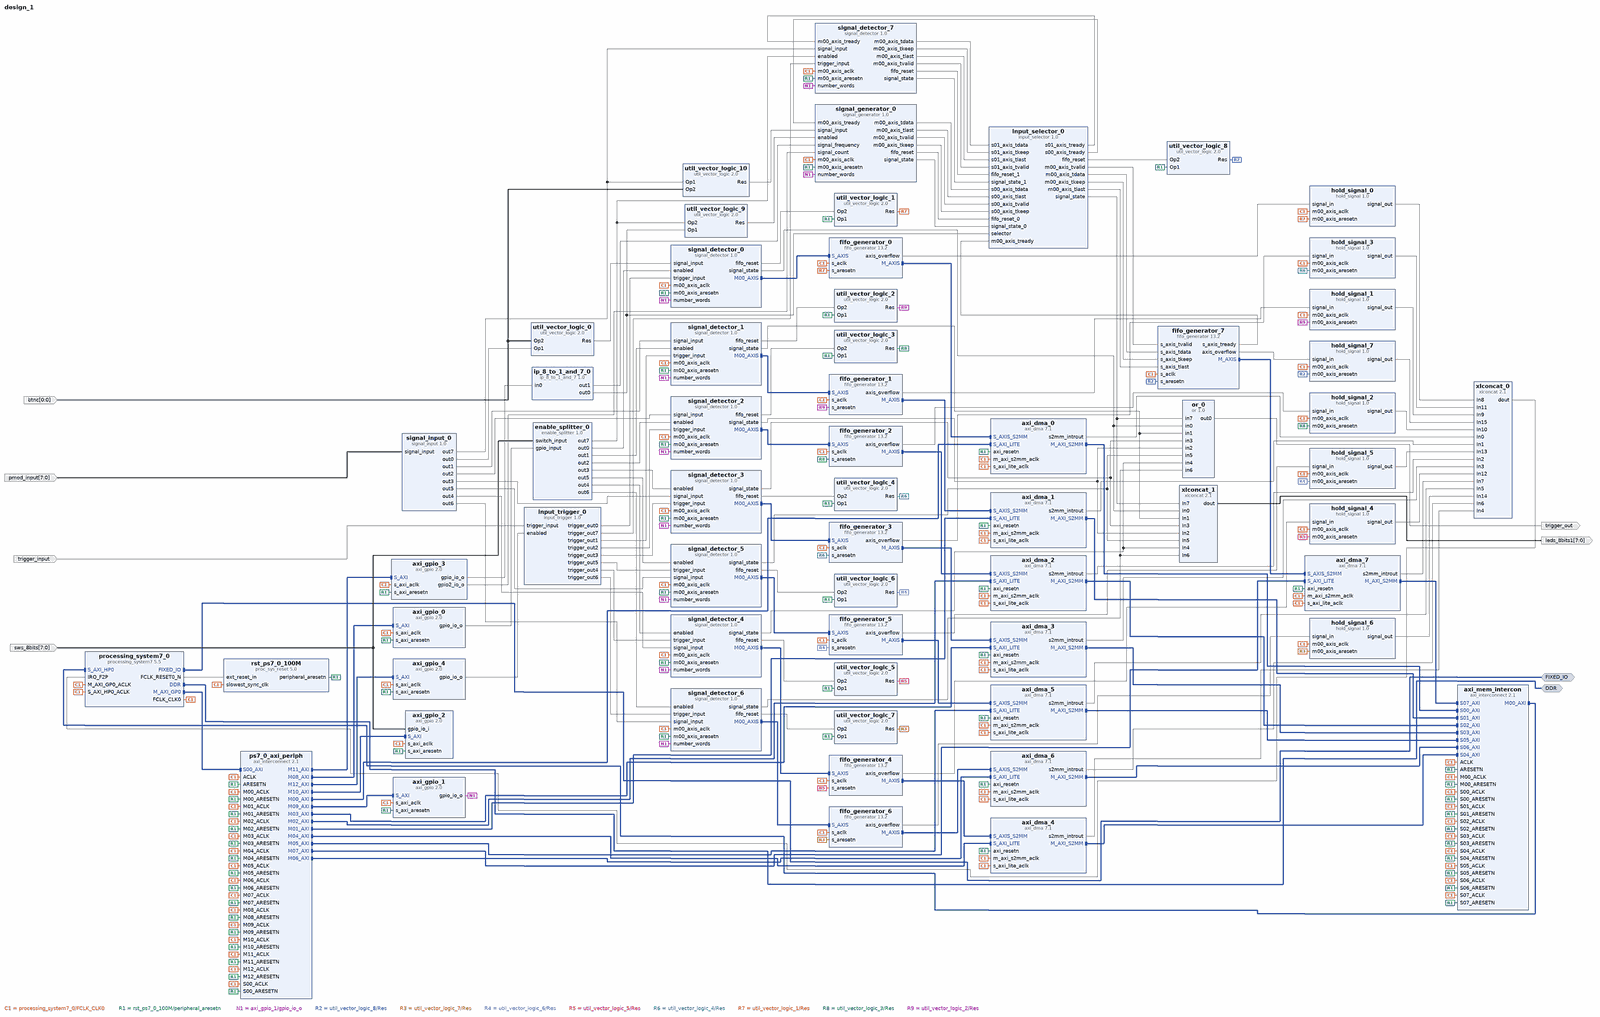
[diagram p0: block diagram of the top level, whole]
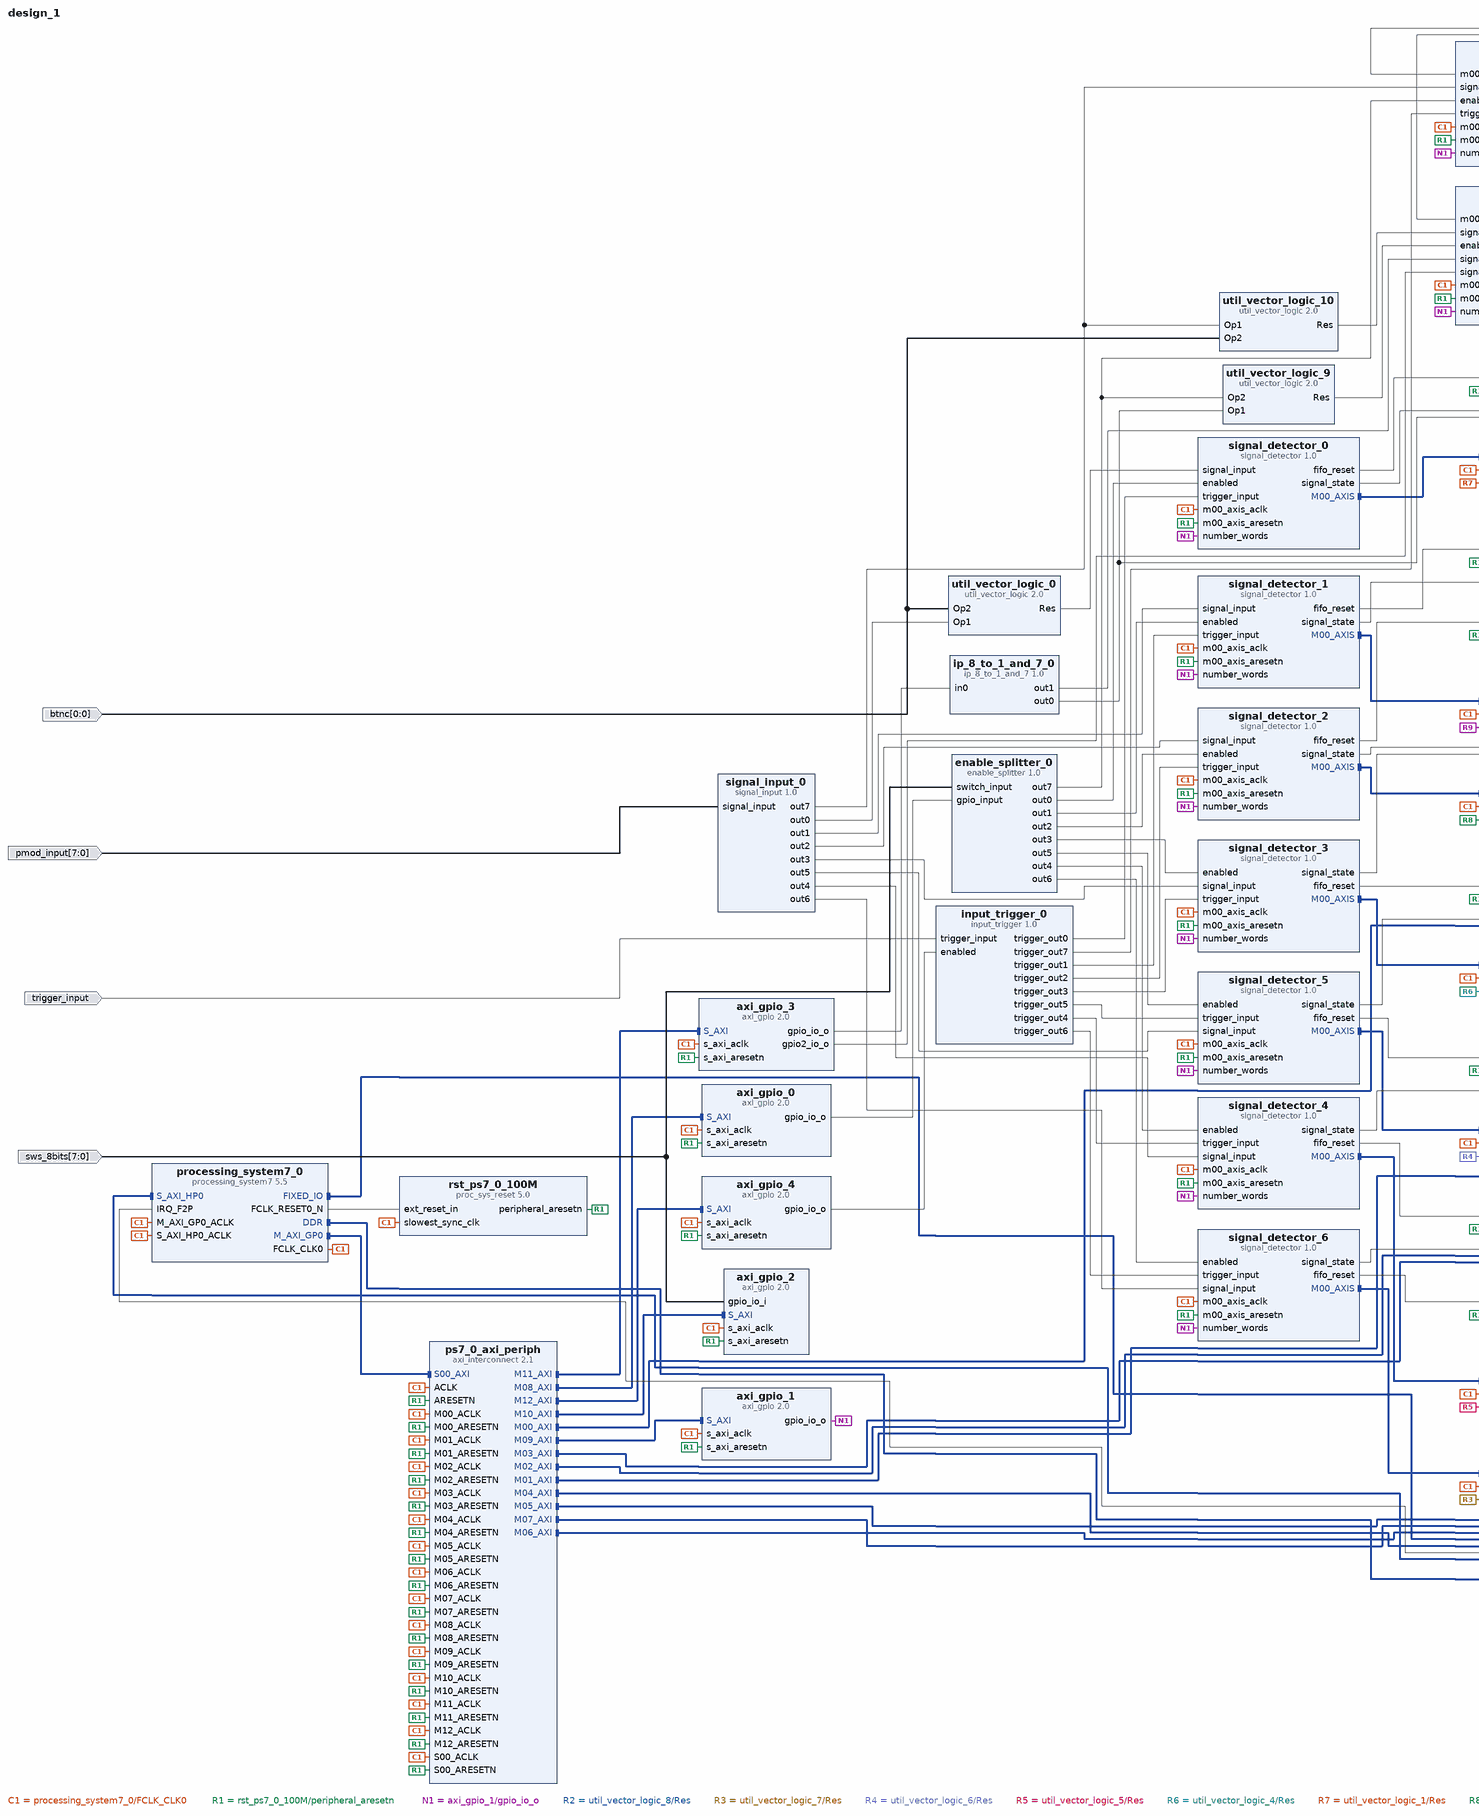
[diagram p1: block diagram of the top level, left part]
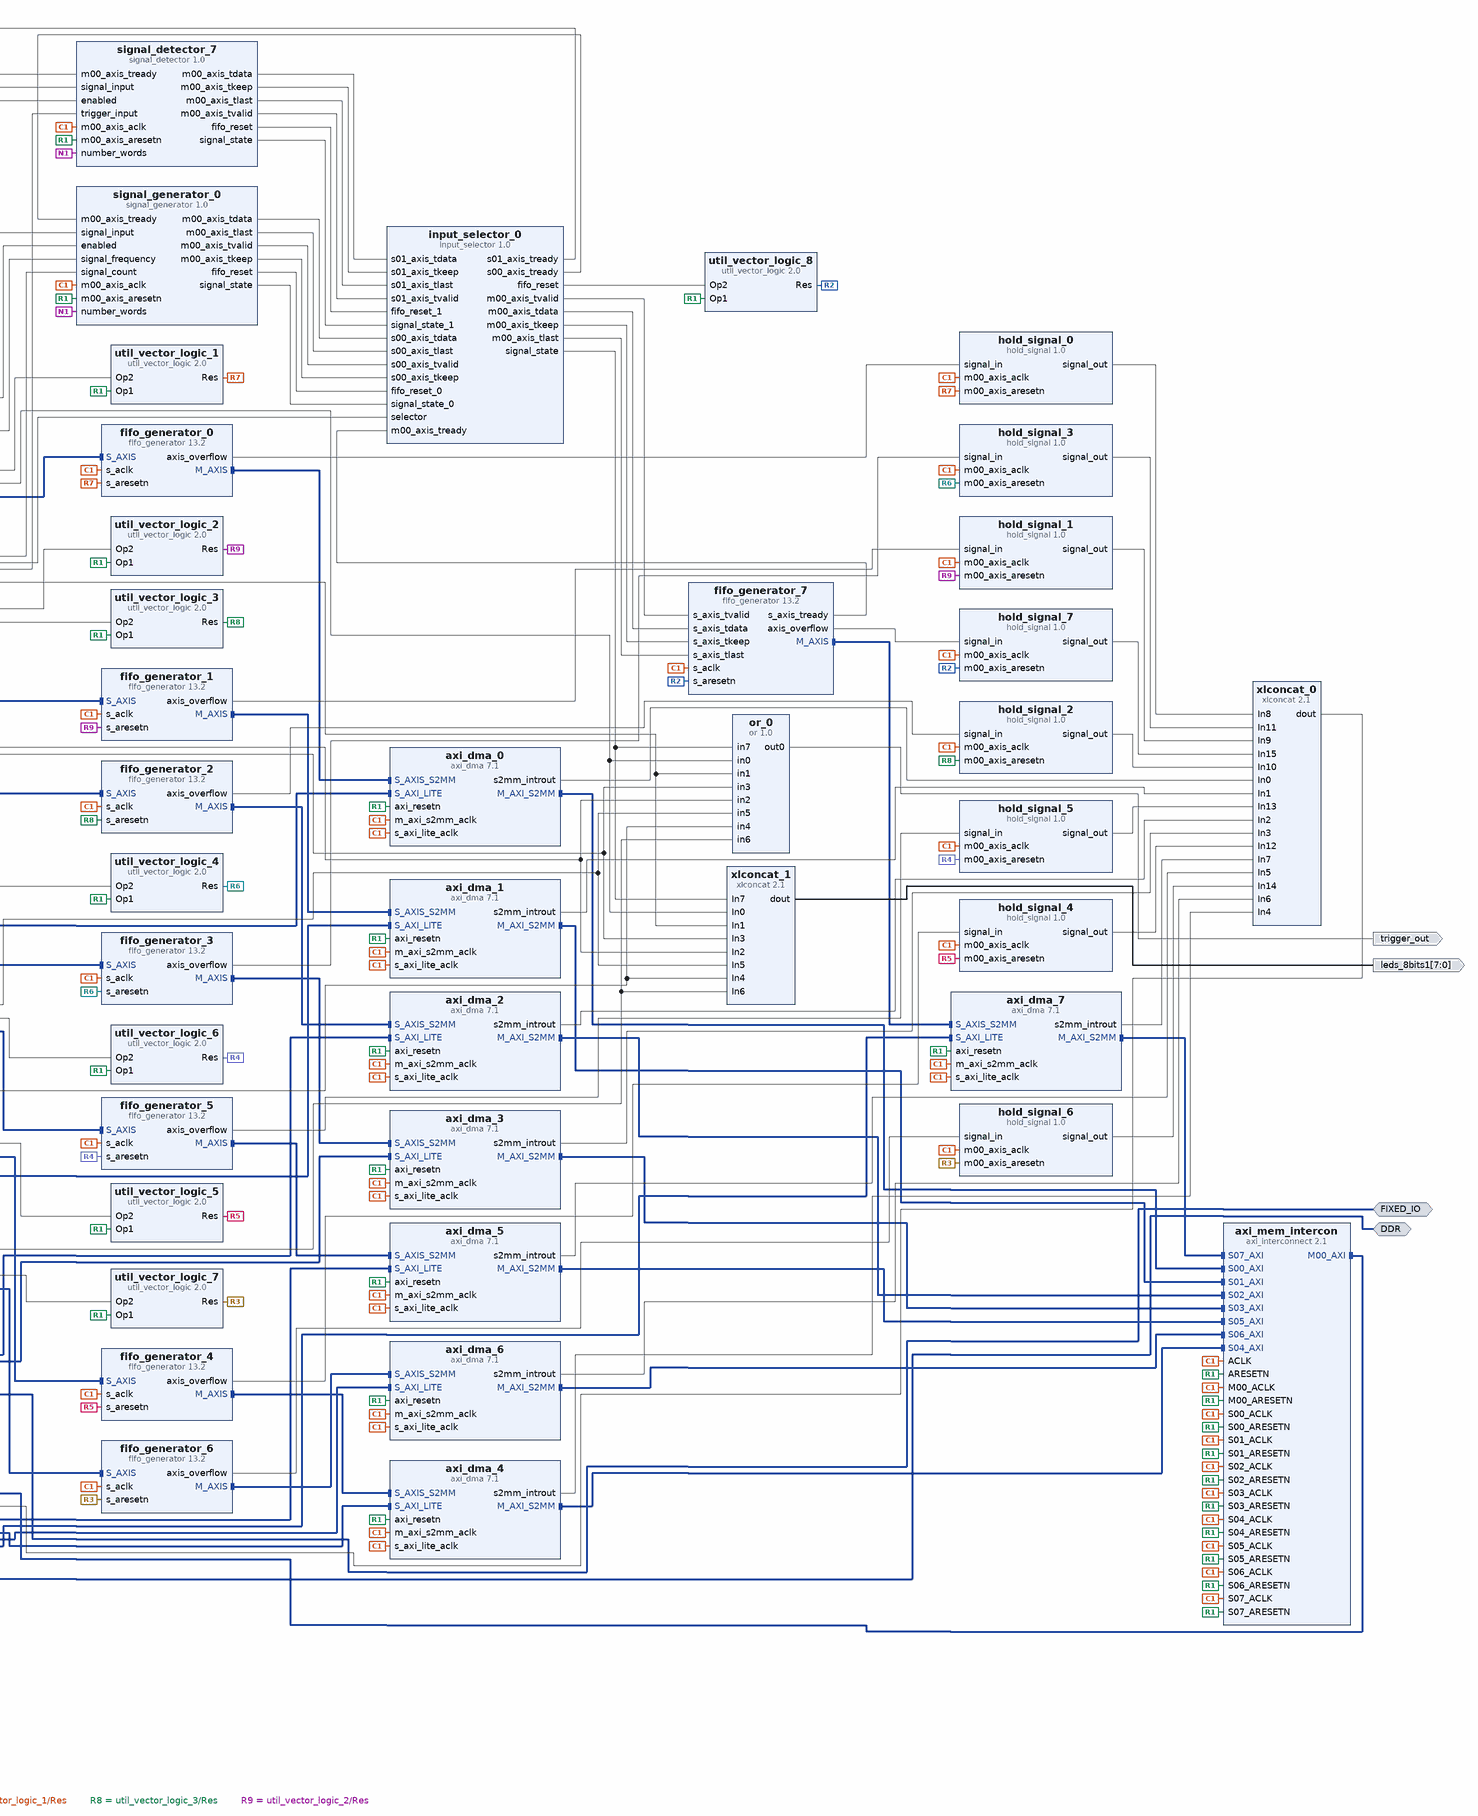
[diagram p2: block diagram of the top level, right part]
# Vivado block design design_1, xc7z020clg484-1, Vivado 2019.2.1
create_bd_design design_1

create_bd_intf_port -mode Master -vlnv xilinx.com:interface:ddrx_rtl:1.0 DDR
create_bd_intf_port -mode Master -vlnv xilinx.com:display_processing_system7:fixedio_rtl:1.0 FIXED_IO
create_bd_port -dir O -from 7 -to 0 leds_8bits1
create_bd_port -dir I -from 7 -to 0 sws_8bits
create_bd_port -dir I -from 7 -to 0 pmod_input
create_bd_port -dir I -from 0 -to 0 btnc
create_bd_port -dir O trigger_out
create_bd_port -dir I trigger_input

create_bd_cell -type ip -vlnv xilinx.com:ip:processing_system7:5.5 processing_system7_0
set_property -dict [list \
  CONFIG.PCW_APU_PERIPHERAL_FREQMHZ 666.666667 \
  CONFIG.PCW_ENET0_ENET0_IO {MIO 16 .. 27} \
  CONFIG.PCW_ENET0_GRP_MDIO_ENABLE 1 \
  CONFIG.PCW_ENET0_GRP_MDIO_IO {MIO 52 .. 53} \
  CONFIG.PCW_ENET0_PERIPHERAL_ENABLE 1 \
  CONFIG.PCW_ENET0_RESET_ENABLE 0 \
  CONFIG.PCW_ENET_RESET_ENABLE 1 \
  CONFIG.PCW_ENET_RESET_SELECT {Share reset pin} \
  CONFIG.PCW_FPGA0_PERIPHERAL_FREQMHZ 100.000000 \
  CONFIG.PCW_FPGA1_PERIPHERAL_FREQMHZ 150.000000 \
  CONFIG.PCW_GPIO_MIO_GPIO_ENABLE 1 \
  CONFIG.PCW_GPIO_MIO_GPIO_IO MIO \
  CONFIG.PCW_I2C_RESET_ENABLE 1 \
  CONFIG.PCW_IRQ_F2P_INTR 1 \
  CONFIG.PCW_PRESET_BANK1_VOLTAGE {LVCMOS 1.8V} \
  CONFIG.PCW_QSPI_GRP_SINGLE_SS_ENABLE 1 \
  CONFIG.PCW_QSPI_GRP_SINGLE_SS_IO {MIO 1 .. 6} \
  CONFIG.PCW_QSPI_PERIPHERAL_ENABLE 1 \
  CONFIG.PCW_QSPI_QSPI_IO {MIO 1 .. 6} \
  CONFIG.PCW_SD0_GRP_CD_ENABLE 1 \
  CONFIG.PCW_SD0_GRP_CD_IO {MIO 47} \
  CONFIG.PCW_SD0_GRP_WP_ENABLE 1 \
  CONFIG.PCW_SD0_GRP_WP_IO {MIO 46} \
  CONFIG.PCW_SD0_PERIPHERAL_ENABLE 1 \
  CONFIG.PCW_SD0_SD0_IO {MIO 40 .. 45} \
  CONFIG.PCW_SDIO_PERIPHERAL_FREQMHZ 50 \
  CONFIG.PCW_SINGLE_QSPI_DATA_MODE x4 \
  CONFIG.PCW_TTC0_PERIPHERAL_ENABLE 1 \
  CONFIG.PCW_TTC0_TTC0_IO EMIO \
  CONFIG.PCW_UART1_PERIPHERAL_ENABLE 1 \
  CONFIG.PCW_UART1_UART1_IO {MIO 48 .. 49} \
  CONFIG.PCW_UART_PERIPHERAL_FREQMHZ 50 \
  CONFIG.PCW_UIPARAM_DDR_FREQ_MHZ 533.333313 \
  CONFIG.PCW_UIPARAM_DDR_PARTNO {MT41J128M16 HA-15E} \
  CONFIG.PCW_USB0_PERIPHERAL_ENABLE 1 \
  CONFIG.PCW_USB0_RESET_ENABLE 0 \
  CONFIG.PCW_USB0_USB0_IO {MIO 28 .. 39} \
  CONFIG.PCW_USB_RESET_ENABLE 1 \
  CONFIG.PCW_USB_RESET_SELECT {Share reset pin} \
  CONFIG.PCW_USE_FABRIC_INTERRUPT 1 \
  CONFIG.PCW_USE_S_AXI_HP0 1 \
  CONFIG.preset ZedBoard \
] [get_bd_cells processing_system7_0]
# 223 more settings of processing_system7_0 are not shown: defaults, MIO pin electricals, DDR timing, and values the tool derives
create_bd_cell -type ip -vlnv xilinx.com:ip:axi_dma:7.1 axi_dma_0
set_property -dict [list \
  CONFIG.c_include_mm2s 0 \
  CONFIG.c_include_sg 0 \
  CONFIG.c_s2mm_burst_size 64 \
  CONFIG.c_sg_length_width 16 \
] [get_bd_cells axi_dma_0]
create_bd_cell -type ip -vlnv xilinx.com:ip:axi_dma:7.1 axi_dma_1
set_property -dict [list \
  CONFIG.c_include_mm2s 0 \
  CONFIG.c_include_sg 0 \
  CONFIG.c_s2mm_burst_size 64 \
  CONFIG.c_sg_length_width 16 \
] [get_bd_cells axi_dma_1]
create_bd_cell -type ip -vlnv xilinx.com:ip:axi_dma:7.1 axi_dma_2
set_property -dict [list \
  CONFIG.c_include_mm2s 0 \
  CONFIG.c_include_sg 0 \
  CONFIG.c_s2mm_burst_size 64 \
  CONFIG.c_sg_length_width 16 \
] [get_bd_cells axi_dma_2]
create_bd_cell -type ip -vlnv xilinx.com:ip:axi_dma:7.1 axi_dma_3
set_property -dict [list \
  CONFIG.c_include_mm2s 0 \
  CONFIG.c_include_sg 0 \
  CONFIG.c_s2mm_burst_size 64 \
  CONFIG.c_sg_length_width 16 \
] [get_bd_cells axi_dma_3]
create_bd_cell -type ip -vlnv xilinx.com:ip:axi_dma:7.1 axi_dma_4
set_property -dict [list \
  CONFIG.c_include_mm2s 0 \
  CONFIG.c_include_sg 0 \
  CONFIG.c_s2mm_burst_size 64 \
  CONFIG.c_sg_length_width 16 \
] [get_bd_cells axi_dma_4]
create_bd_cell -type ip -vlnv xilinx.com:ip:axi_dma:7.1 axi_dma_5
set_property -dict [list \
  CONFIG.c_include_mm2s 0 \
  CONFIG.c_include_sg 0 \
  CONFIG.c_s2mm_burst_size 64 \
  CONFIG.c_sg_length_width 16 \
] [get_bd_cells axi_dma_5]
create_bd_cell -type ip -vlnv xilinx.com:ip:axi_dma:7.1 axi_dma_6
set_property -dict [list \
  CONFIG.c_include_mm2s 0 \
  CONFIG.c_include_sg 0 \
  CONFIG.c_s2mm_burst_size 32 \
  CONFIG.c_sg_length_width 16 \
] [get_bd_cells axi_dma_6]
create_bd_cell -type ip -vlnv xilinx.com:ip:axi_dma:7.1 axi_dma_7
set_property -dict [list \
  CONFIG.c_include_mm2s 0 \
  CONFIG.c_include_sg 0 \
  CONFIG.c_s2mm_burst_size 64 \
  CONFIG.c_sg_length_width 16 \
] [get_bd_cells axi_dma_7]
create_bd_cell -type ip -vlnv xilinx.com:ip:axi_interconnect:2.1 ps7_0_axi_periph
set_property -dict {CONFIG.NUM_MI 13} [get_bd_cells ps7_0_axi_periph]
create_bd_cell -type ip -vlnv xilinx.com:ip:proc_sys_reset:5.0 rst_ps7_0_100M
create_bd_cell -type ip -vlnv xilinx.com:ip:axi_interconnect:2.1 axi_mem_intercon
set_property -dict {CONFIG.NUM_MI 1 CONFIG.NUM_SI 8} [get_bd_cells axi_mem_intercon]
create_bd_cell -type ip -vlnv xilinx.com:ip:xlconcat:2.1 xlconcat_0
set_property -dict {CONFIG.NUM_PORTS 16} [get_bd_cells xlconcat_0]
create_bd_cell -type ip -vlnv xilinx.com:ip:xlconcat:2.1 xlconcat_1
set_property -dict {CONFIG.NUM_PORTS 8} [get_bd_cells xlconcat_1]
create_bd_cell -type ip -vlnv user.org:user:enable_splitter:1.0 enable_splitter_0
create_bd_cell -type ip -vlnv xilinx.com:ip:axi_gpio:2.0 axi_gpio_0
set_property -dict {CONFIG.C_ALL_OUTPUTS 1 CONFIG.C_GPIO_WIDTH 8} [get_bd_cells axi_gpio_0]
create_bd_cell -type ip -vlnv user.org:user:signal_input:1.0 signal_input_0
create_bd_cell -type ip -vlnv xilinx.com:ip:util_vector_logic:2.0 util_vector_logic_0
set_property -dict {CONFIG.C_OPERATION or CONFIG.C_SIZE 1} [get_bd_cells util_vector_logic_0]
create_bd_cell -type ip -vlnv xilinx.com:ip:util_vector_logic:2.0 util_vector_logic_1
set_property -dict {CONFIG.C_SIZE 1} [get_bd_cells util_vector_logic_1]
create_bd_cell -type ip -vlnv xilinx.com:ip:util_vector_logic:2.0 util_vector_logic_2
set_property -dict {CONFIG.C_SIZE 1} [get_bd_cells util_vector_logic_2]
create_bd_cell -type ip -vlnv xilinx.com:ip:util_vector_logic:2.0 util_vector_logic_3
set_property -dict {CONFIG.C_SIZE 1} [get_bd_cells util_vector_logic_3]
create_bd_cell -type ip -vlnv xilinx.com:ip:util_vector_logic:2.0 util_vector_logic_4
set_property -dict {CONFIG.C_SIZE 1} [get_bd_cells util_vector_logic_4]
create_bd_cell -type ip -vlnv xilinx.com:ip:util_vector_logic:2.0 util_vector_logic_5
set_property -dict {CONFIG.C_SIZE 1} [get_bd_cells util_vector_logic_5]
create_bd_cell -type ip -vlnv xilinx.com:ip:util_vector_logic:2.0 util_vector_logic_6
set_property -dict {CONFIG.C_SIZE 1} [get_bd_cells util_vector_logic_6]
create_bd_cell -type ip -vlnv xilinx.com:ip:util_vector_logic:2.0 util_vector_logic_7
set_property -dict {CONFIG.C_SIZE 1} [get_bd_cells util_vector_logic_7]
create_bd_cell -type ip -vlnv xilinx.com:ip:util_vector_logic:2.0 util_vector_logic_8
set_property -dict {CONFIG.C_SIZE 1} [get_bd_cells util_vector_logic_8]
create_bd_cell -type ip -vlnv xilinx.com:ip:axi_gpio:2.0 axi_gpio_1
set_property -dict {CONFIG.C_ALL_OUTPUTS 1 CONFIG.C_DOUT_DEFAULT 0x00000020 CONFIG.C_GPIO_WIDTH 16} [get_bd_cells axi_gpio_1]
create_bd_cell -type ip -vlnv xilinx.com:ip:axi_gpio:2.0 axi_gpio_2
set_property -dict {CONFIG.C_ALL_INPUTS 1 CONFIG.C_GPIO_WIDTH 8} [get_bd_cells axi_gpio_2]
create_bd_cell -type ip -vlnv xilinx.com:ip:util_vector_logic:2.0 util_vector_logic_9
set_property -dict {CONFIG.C_SIZE 1} [get_bd_cells util_vector_logic_9]
create_bd_cell -type ip -vlnv user.org:user:input_selector:1.0 input_selector_0
create_bd_cell -type ip -vlnv xilinx.com:ip:axi_gpio:2.0 axi_gpio_3
set_property -dict [list \
  CONFIG.C_ALL_OUTPUTS 1 \
  CONFIG.C_ALL_OUTPUTS_2 1 \
  CONFIG.C_GPIO_WIDTH 29 \
  CONFIG.C_IS_DUAL 1 \
] [get_bd_cells axi_gpio_3]
create_bd_cell -type ip -vlnv user.org:user:input_trigger:1.0 input_trigger_0
create_bd_cell -type ip -vlnv xilinx.com:ip:axi_gpio:2.0 axi_gpio_4
set_property -dict {CONFIG.C_ALL_OUTPUTS 1 CONFIG.C_GPIO_WIDTH 1} [get_bd_cells axi_gpio_4]
create_bd_cell -type ip -vlnv user.org:user:or:1.0 or_0
create_bd_cell -type ip -vlnv xilinx.com:ip:util_vector_logic:2.0 util_vector_logic_10
set_property -dict {CONFIG.C_OPERATION or CONFIG.C_SIZE 1} [get_bd_cells util_vector_logic_10]
create_bd_cell -type ip -vlnv xilinx.com:ip:fifo_generator:13.2 fifo_generator_0
set_property -dict [list \
  CONFIG.Enable_Data_Counts_axis false \
  CONFIG.Enable_ECC_axis false \
  CONFIG.Enable_Safety_Circuit true \
  CONFIG.Enable_TLAST true \
  CONFIG.FIFO_Implementation_rach Common_Clock_Distributed_RAM \
  CONFIG.FIFO_Implementation_wach Common_Clock_Distributed_RAM \
  CONFIG.FIFO_Implementation_wrch Common_Clock_Distributed_RAM \
  CONFIG.Full_Flags_Reset_Value 1 \
  CONFIG.HAS_ACLKEN false \
  CONFIG.HAS_TKEEP true \
  CONFIG.INTERFACE_TYPE AXI_STREAM \
  CONFIG.Input_Depth_axis 16384 \
  CONFIG.Overflow_Flag_AXI true \
  CONFIG.TDATA_NUM_BYTES 4 \
  CONFIG.TUSER_WIDTH 0 \
] [get_bd_cells fifo_generator_0]
create_bd_cell -type ip -vlnv xilinx.com:ip:fifo_generator:13.2 fifo_generator_1
set_property -dict [list \
  CONFIG.Enable_Data_Counts_axis false \
  CONFIG.Enable_ECC_axis false \
  CONFIG.Enable_Safety_Circuit true \
  CONFIG.Enable_TLAST true \
  CONFIG.FIFO_Implementation_rach Common_Clock_Distributed_RAM \
  CONFIG.FIFO_Implementation_wach Common_Clock_Distributed_RAM \
  CONFIG.FIFO_Implementation_wrch Common_Clock_Distributed_RAM \
  CONFIG.Full_Flags_Reset_Value 1 \
  CONFIG.HAS_ACLKEN false \
  CONFIG.HAS_TKEEP true \
  CONFIG.INTERFACE_TYPE AXI_STREAM \
  CONFIG.Input_Depth_axis 16384 \
  CONFIG.Overflow_Flag_AXI true \
  CONFIG.TDATA_NUM_BYTES 4 \
  CONFIG.TUSER_WIDTH 0 \
] [get_bd_cells fifo_generator_1]
create_bd_cell -type ip -vlnv xilinx.com:ip:fifo_generator:13.2 fifo_generator_2
set_property -dict [list \
  CONFIG.Enable_Data_Counts_axis false \
  CONFIG.Enable_ECC_axis false \
  CONFIG.Enable_Safety_Circuit true \
  CONFIG.Enable_TLAST true \
  CONFIG.FIFO_Implementation_rach Common_Clock_Distributed_RAM \
  CONFIG.FIFO_Implementation_wach Common_Clock_Distributed_RAM \
  CONFIG.FIFO_Implementation_wrch Common_Clock_Distributed_RAM \
  CONFIG.Full_Flags_Reset_Value 1 \
  CONFIG.HAS_ACLKEN false \
  CONFIG.HAS_TKEEP true \
  CONFIG.INTERFACE_TYPE AXI_STREAM \
  CONFIG.Input_Depth_axis 16384 \
  CONFIG.Overflow_Flag_AXI true \
  CONFIG.TDATA_NUM_BYTES 4 \
  CONFIG.TUSER_WIDTH 0 \
] [get_bd_cells fifo_generator_2]
create_bd_cell -type ip -vlnv xilinx.com:ip:fifo_generator:13.2 fifo_generator_3
set_property -dict [list \
  CONFIG.Enable_Data_Counts_axis false \
  CONFIG.Enable_ECC_axis false \
  CONFIG.Enable_Safety_Circuit true \
  CONFIG.Enable_TLAST true \
  CONFIG.FIFO_Implementation_rach Common_Clock_Distributed_RAM \
  CONFIG.FIFO_Implementation_wach Common_Clock_Distributed_RAM \
  CONFIG.FIFO_Implementation_wrch Common_Clock_Distributed_RAM \
  CONFIG.Full_Flags_Reset_Value 1 \
  CONFIG.HAS_ACLKEN false \
  CONFIG.HAS_TKEEP true \
  CONFIG.INTERFACE_TYPE AXI_STREAM \
  CONFIG.Input_Depth_axis 16384 \
  CONFIG.Overflow_Flag_AXI true \
  CONFIG.TDATA_NUM_BYTES 4 \
  CONFIG.TUSER_WIDTH 0 \
] [get_bd_cells fifo_generator_3]
create_bd_cell -type ip -vlnv xilinx.com:ip:fifo_generator:13.2 fifo_generator_4
set_property -dict [list \
  CONFIG.Enable_Data_Counts_axis false \
  CONFIG.Enable_ECC_axis false \
  CONFIG.Enable_Safety_Circuit true \
  CONFIG.Enable_TLAST true \
  CONFIG.FIFO_Implementation_rach Common_Clock_Distributed_RAM \
  CONFIG.FIFO_Implementation_wach Common_Clock_Distributed_RAM \
  CONFIG.FIFO_Implementation_wrch Common_Clock_Distributed_RAM \
  CONFIG.Full_Flags_Reset_Value 1 \
  CONFIG.HAS_ACLKEN false \
  CONFIG.HAS_TKEEP true \
  CONFIG.INTERFACE_TYPE AXI_STREAM \
  CONFIG.Input_Depth_axis 16384 \
  CONFIG.Overflow_Flag_AXI true \
  CONFIG.TDATA_NUM_BYTES 4 \
  CONFIG.TUSER_WIDTH 0 \
] [get_bd_cells fifo_generator_4]
create_bd_cell -type ip -vlnv xilinx.com:ip:fifo_generator:13.2 fifo_generator_5
set_property -dict [list \
  CONFIG.Enable_Data_Counts_axis false \
  CONFIG.Enable_ECC_axis false \
  CONFIG.Enable_Safety_Circuit true \
  CONFIG.Enable_TLAST true \
  CONFIG.FIFO_Implementation_rach Common_Clock_Distributed_RAM \
  CONFIG.FIFO_Implementation_wach Common_Clock_Distributed_RAM \
  CONFIG.FIFO_Implementation_wrch Common_Clock_Distributed_RAM \
  CONFIG.Full_Flags_Reset_Value 1 \
  CONFIG.HAS_ACLKEN false \
  CONFIG.HAS_TKEEP true \
  CONFIG.INTERFACE_TYPE AXI_STREAM \
  CONFIG.Input_Depth_axis 16384 \
  CONFIG.Overflow_Flag_AXI true \
  CONFIG.TDATA_NUM_BYTES 4 \
  CONFIG.TUSER_WIDTH 0 \
] [get_bd_cells fifo_generator_5]
create_bd_cell -type ip -vlnv xilinx.com:ip:fifo_generator:13.2 fifo_generator_6
set_property -dict [list \
  CONFIG.Enable_Data_Counts_axis false \
  CONFIG.Enable_ECC_axis false \
  CONFIG.Enable_Safety_Circuit true \
  CONFIG.Enable_TLAST true \
  CONFIG.FIFO_Implementation_rach Common_Clock_Distributed_RAM \
  CONFIG.FIFO_Implementation_wach Common_Clock_Distributed_RAM \
  CONFIG.FIFO_Implementation_wrch Common_Clock_Distributed_RAM \
  CONFIG.Full_Flags_Reset_Value 1 \
  CONFIG.HAS_ACLKEN false \
  CONFIG.HAS_TKEEP true \
  CONFIG.INTERFACE_TYPE AXI_STREAM \
  CONFIG.Input_Depth_axis 16384 \
  CONFIG.Overflow_Flag_AXI true \
  CONFIG.TDATA_NUM_BYTES 4 \
  CONFIG.TUSER_WIDTH 0 \
] [get_bd_cells fifo_generator_6]
create_bd_cell -type ip -vlnv xilinx.com:ip:fifo_generator:13.2 fifo_generator_7
set_property -dict [list \
  CONFIG.Enable_Data_Counts_axis false \
  CONFIG.Enable_ECC_axis false \
  CONFIG.Enable_Safety_Circuit true \
  CONFIG.Enable_TLAST true \
  CONFIG.FIFO_Implementation_rach Common_Clock_Distributed_RAM \
  CONFIG.FIFO_Implementation_wach Common_Clock_Distributed_RAM \
  CONFIG.FIFO_Implementation_wrch Common_Clock_Distributed_RAM \
  CONFIG.Full_Flags_Reset_Value 1 \
  CONFIG.HAS_ACLKEN false \
  CONFIG.HAS_TKEEP true \
  CONFIG.INTERFACE_TYPE AXI_STREAM \
  CONFIG.Input_Depth_axis 16384 \
  CONFIG.Overflow_Flag_AXI true \
  CONFIG.TDATA_NUM_BYTES 4 \
  CONFIG.TUSER_WIDTH 0 \
] [get_bd_cells fifo_generator_7]
create_bd_cell -type ip -vlnv akr.neutron:user:signal_detector:1.0 signal_detector_0
create_bd_cell -type ip -vlnv akr.neutron:user:signal_detector:1.0 signal_detector_1
create_bd_cell -type ip -vlnv akr.neutron:user:signal_detector:1.0 signal_detector_2
create_bd_cell -type ip -vlnv akr.neutron:user:signal_detector:1.0 signal_detector_3
create_bd_cell -type ip -vlnv akr.neutron:user:signal_detector:1.0 signal_detector_4
create_bd_cell -type ip -vlnv akr.neutron:user:signal_detector:1.0 signal_detector_5
create_bd_cell -type ip -vlnv akr.neutron:user:signal_detector:1.0 signal_detector_7
create_bd_cell -type ip -vlnv akr.neutron:user:signal_detector:1.0 signal_detector_6
create_bd_cell -type ip -vlnv user.org:user:ip_8_to_1_and_7:1.0 ip_8_to_1_and_7_0
create_bd_cell -type ip -vlnv user.org:user:signal_generator:1.0 signal_generator_0
create_bd_cell -type ip -vlnv user.org:user:hold_signal:1.0 hold_signal_0
create_bd_cell -type ip -vlnv user.org:user:hold_signal:1.0 hold_signal_1
create_bd_cell -type ip -vlnv user.org:user:hold_signal:1.0 hold_signal_2
create_bd_cell -type ip -vlnv user.org:user:hold_signal:1.0 hold_signal_3
create_bd_cell -type ip -vlnv user.org:user:hold_signal:1.0 hold_signal_4
create_bd_cell -type ip -vlnv user.org:user:hold_signal:1.0 hold_signal_5
create_bd_cell -type ip -vlnv user.org:user:hold_signal:1.0 hold_signal_6
create_bd_cell -type ip -vlnv user.org:user:hold_signal:1.0 hold_signal_7

# ---- connections ----

connect_bd_intf_net [get_bd_intf_pins fifo_generator_5/M_AXIS] [get_bd_intf_pins axi_dma_5/S_AXIS_S2MM]
connect_bd_intf_net [get_bd_intf_pins fifo_generator_2/M_AXIS] [get_bd_intf_pins axi_dma_2/S_AXIS_S2MM]
connect_bd_intf_net [get_bd_intf_pins signal_detector_1/M00_AXIS] [get_bd_intf_pins fifo_generator_1/S_AXIS]
connect_bd_intf_net [get_bd_intf_pins ps7_0_axi_periph/M04_AXI] [get_bd_intf_pins axi_dma_4/S_AXI_LITE]
connect_bd_intf_net [get_bd_intf_pins axi_dma_0/M_AXI_S2MM] [get_bd_intf_pins axi_mem_intercon/S00_AXI]
connect_bd_intf_net [get_bd_intf_pins signal_detector_3/M00_AXIS] [get_bd_intf_pins fifo_generator_3/S_AXIS]
connect_bd_intf_net [get_bd_intf_pins ps7_0_axi_periph/M12_AXI] [get_bd_intf_pins axi_gpio_4/S_AXI]
connect_bd_intf_net [get_bd_intf_pins axi_dma_0/S_AXIS_S2MM] [get_bd_intf_pins fifo_generator_0/M_AXIS]
connect_bd_intf_net [get_bd_intf_pins ps7_0_axi_periph/M03_AXI] [get_bd_intf_pins axi_dma_3/S_AXI_LITE]
connect_bd_intf_net [get_bd_intf_pins processing_system7_0/M_AXI_GP0] [get_bd_intf_pins ps7_0_axi_periph/S00_AXI]
connect_bd_intf_net [get_bd_intf_pins signal_detector_0/M00_AXIS] [get_bd_intf_pins fifo_generator_0/S_AXIS]
connect_bd_intf_net [get_bd_intf_pins fifo_generator_7/M_AXIS] [get_bd_intf_pins axi_dma_7/S_AXIS_S2MM]
connect_bd_intf_net [get_bd_intf_pins ps7_0_axi_periph/M10_AXI] [get_bd_intf_pins axi_gpio_2/S_AXI]
connect_bd_intf_net [get_bd_intf_pins axi_dma_7/M_AXI_S2MM] [get_bd_intf_pins axi_mem_intercon/S07_AXI]
connect_bd_intf_net [get_bd_intf_pins ps7_0_axi_periph/M08_AXI] [get_bd_intf_pins axi_gpio_0/S_AXI]
connect_bd_intf_net [get_bd_intf_pins axi_dma_2/M_AXI_S2MM] [get_bd_intf_pins axi_mem_intercon/S02_AXI]
connect_bd_intf_net [get_bd_intf_pins fifo_generator_1/M_AXIS] [get_bd_intf_pins axi_dma_1/S_AXIS_S2MM]
connect_bd_intf_net [get_bd_intf_pins axi_dma_6/M_AXI_S2MM] [get_bd_intf_pins axi_mem_intercon/S06_AXI]
connect_bd_intf_net [get_bd_intf_pins signal_detector_2/M00_AXIS] [get_bd_intf_pins fifo_generator_2/S_AXIS]
connect_bd_intf_net [get_bd_intf_pins signal_detector_4/M00_AXIS] [get_bd_intf_pins fifo_generator_4/S_AXIS]
connect_bd_intf_net [get_bd_intf_ports FIXED_IO] [get_bd_intf_pins processing_system7_0/FIXED_IO]
connect_bd_intf_net [get_bd_intf_pins fifo_generator_4/M_AXIS] [get_bd_intf_pins axi_dma_4/S_AXIS_S2MM]
connect_bd_intf_net [get_bd_intf_pins ps7_0_axi_periph/M09_AXI] [get_bd_intf_pins axi_gpio_1/S_AXI]
connect_bd_intf_net [get_bd_intf_pins ps7_0_axi_periph/M02_AXI] [get_bd_intf_pins axi_dma_2/S_AXI_LITE]
connect_bd_intf_net [get_bd_intf_pins axi_dma_3/M_AXI_S2MM] [get_bd_intf_pins axi_mem_intercon/S03_AXI]
connect_bd_intf_net [get_bd_intf_pins ps7_0_axi_periph/M11_AXI] [get_bd_intf_pins axi_gpio_3/S_AXI]
connect_bd_intf_net [get_bd_intf_pins ps7_0_axi_periph/M05_AXI] [get_bd_intf_pins axi_dma_5/S_AXI_LITE]
connect_bd_intf_net [get_bd_intf_pins ps7_0_axi_periph/M00_AXI] [get_bd_intf_pins axi_dma_0/S_AXI_LITE]
connect_bd_intf_net [get_bd_intf_pins fifo_generator_6/M_AXIS] [get_bd_intf_pins axi_dma_6/S_AXIS_S2MM]
connect_bd_intf_net [get_bd_intf_pins ps7_0_axi_periph/M07_AXI] [get_bd_intf_pins axi_dma_7/S_AXI_LITE]
connect_bd_intf_net [get_bd_intf_pins fifo_generator_3/M_AXIS] [get_bd_intf_pins axi_dma_3/S_AXIS_S2MM]
connect_bd_intf_net [get_bd_intf_pins ps7_0_axi_periph/M01_AXI] [get_bd_intf_pins axi_dma_1/S_AXI_LITE]
connect_bd_intf_net [get_bd_intf_pins axi_mem_intercon/M00_AXI] [get_bd_intf_pins processing_system7_0/S_AXI_HP0]
connect_bd_intf_net [get_bd_intf_pins axi_dma_4/M_AXI_S2MM] [get_bd_intf_pins axi_mem_intercon/S04_AXI]
connect_bd_intf_net [get_bd_intf_pins axi_dma_5/M_AXI_S2MM] [get_bd_intf_pins axi_mem_intercon/S05_AXI]
connect_bd_intf_net [get_bd_intf_pins axi_dma_1/M_AXI_S2MM] [get_bd_intf_pins axi_mem_intercon/S01_AXI]
connect_bd_intf_net [get_bd_intf_pins signal_detector_6/M00_AXIS] [get_bd_intf_pins fifo_generator_6/S_AXIS]
connect_bd_intf_net [get_bd_intf_pins signal_detector_5/M00_AXIS] [get_bd_intf_pins fifo_generator_5/S_AXIS]
connect_bd_intf_net [get_bd_intf_pins ps7_0_axi_periph/M06_AXI] [get_bd_intf_pins axi_dma_6/S_AXI_LITE]
connect_bd_intf_net [get_bd_intf_ports DDR] [get_bd_intf_pins processing_system7_0/DDR]
connect_bd_net [get_bd_pins processing_system7_0/FCLK_CLK0] \
  [get_bd_pins processing_system7_0/M_AXI_GP0_ACLK] [get_bd_pins ps7_0_axi_periph/S00_ACLK] \
  [get_bd_pins rst_ps7_0_100M/slowest_sync_clk] [get_bd_pins axi_dma_0/s_axi_lite_aclk] \
  [get_bd_pins ps7_0_axi_periph/M00_ACLK] [get_bd_pins ps7_0_axi_periph/ACLK] [get_bd_pins axi_dma_1/s_axi_lite_aclk] \
  [get_bd_pins ps7_0_axi_periph/M01_ACLK] [get_bd_pins axi_dma_2/s_axi_lite_aclk] [get_bd_pins ps7_0_axi_periph/M02_ACLK] \
  [get_bd_pins axi_dma_3/s_axi_lite_aclk] [get_bd_pins ps7_0_axi_periph/M03_ACLK] [get_bd_pins axi_dma_4/s_axi_lite_aclk] \
  [get_bd_pins ps7_0_axi_periph/M04_ACLK] [get_bd_pins axi_dma_5/s_axi_lite_aclk] [get_bd_pins ps7_0_axi_periph/M05_ACLK] \
  [get_bd_pins axi_dma_6/s_axi_lite_aclk] [get_bd_pins ps7_0_axi_periph/M06_ACLK] [get_bd_pins axi_dma_7/s_axi_lite_aclk] \
  [get_bd_pins ps7_0_axi_periph/M07_ACLK] [get_bd_pins axi_dma_0/m_axi_s2mm_aclk] [get_bd_pins axi_mem_intercon/S00_ACLK] \
  [get_bd_pins processing_system7_0/S_AXI_HP0_ACLK] [get_bd_pins axi_mem_intercon/M00_ACLK] \
  [get_bd_pins axi_mem_intercon/ACLK] [get_bd_pins axi_dma_1/m_axi_s2mm_aclk] [get_bd_pins axi_dma_2/m_axi_s2mm_aclk] \
  [get_bd_pins axi_dma_3/m_axi_s2mm_aclk] [get_bd_pins axi_dma_4/m_axi_s2mm_aclk] [get_bd_pins axi_dma_5/m_axi_s2mm_aclk] \
  [get_bd_pins axi_dma_6/m_axi_s2mm_aclk] [get_bd_pins axi_dma_7/m_axi_s2mm_aclk] [get_bd_pins axi_mem_intercon/S01_ACLK] \
  [get_bd_pins axi_mem_intercon/S02_ACLK] [get_bd_pins axi_mem_intercon/S03_ACLK] [get_bd_pins axi_mem_intercon/S04_ACLK] \
  [get_bd_pins axi_mem_intercon/S05_ACLK] [get_bd_pins axi_mem_intercon/S06_ACLK] [get_bd_pins axi_mem_intercon/S07_ACLK] \
  [get_bd_pins axi_gpio_0/s_axi_aclk] [get_bd_pins ps7_0_axi_periph/M08_ACLK] [get_bd_pins ps7_0_axi_periph/M09_ACLK] \
  [get_bd_pins axi_gpio_1/s_axi_aclk] [get_bd_pins axi_gpio_2/s_axi_aclk] [get_bd_pins ps7_0_axi_periph/M10_ACLK] \
  [get_bd_pins axi_gpio_3/s_axi_aclk] [get_bd_pins ps7_0_axi_periph/M11_ACLK] [get_bd_pins axi_gpio_4/s_axi_aclk] \
  [get_bd_pins ps7_0_axi_periph/M12_ACLK] [get_bd_pins fifo_generator_0/s_aclk] [get_bd_pins fifo_generator_1/s_aclk] \
  [get_bd_pins fifo_generator_2/s_aclk] [get_bd_pins fifo_generator_3/s_aclk] [get_bd_pins fifo_generator_4/s_aclk] \
  [get_bd_pins fifo_generator_5/s_aclk] [get_bd_pins fifo_generator_6/s_aclk] [get_bd_pins fifo_generator_7/s_aclk] \
  [get_bd_pins signal_detector_0/m00_axis_aclk] [get_bd_pins signal_detector_1/m00_axis_aclk] \
  [get_bd_pins signal_detector_2/m00_axis_aclk] [get_bd_pins signal_detector_3/m00_axis_aclk] \
  [get_bd_pins signal_detector_4/m00_axis_aclk] [get_bd_pins signal_detector_5/m00_axis_aclk] \
  [get_bd_pins signal_detector_7/m00_axis_aclk] [get_bd_pins signal_detector_6/m00_axis_aclk] \
  [get_bd_pins signal_generator_0/m00_axis_aclk] [get_bd_pins hold_signal_2/m00_axis_aclk] \
  [get_bd_pins hold_signal_4/m00_axis_aclk] [get_bd_pins hold_signal_5/m00_axis_aclk] \
  [get_bd_pins hold_signal_7/m00_axis_aclk] [get_bd_pins hold_signal_6/m00_axis_aclk] \
  [get_bd_pins hold_signal_3/m00_axis_aclk] [get_bd_pins hold_signal_0/m00_axis_aclk] \
  [get_bd_pins hold_signal_1/m00_axis_aclk]
connect_bd_net [get_bd_pins processing_system7_0/FCLK_RESET0_N] [get_bd_pins rst_ps7_0_100M/ext_reset_in]
connect_bd_net [get_bd_pins rst_ps7_0_100M/peripheral_aresetn] \
  [get_bd_pins ps7_0_axi_periph/S00_ARESETN] [get_bd_pins axi_dma_0/axi_resetn] [get_bd_pins ps7_0_axi_periph/M00_ARESETN] \
  [get_bd_pins ps7_0_axi_periph/ARESETN] [get_bd_pins axi_dma_1/axi_resetn] [get_bd_pins ps7_0_axi_periph/M01_ARESETN] \
  [get_bd_pins axi_dma_2/axi_resetn] [get_bd_pins ps7_0_axi_periph/M02_ARESETN] [get_bd_pins axi_dma_3/axi_resetn] \
  [get_bd_pins ps7_0_axi_periph/M03_ARESETN] [get_bd_pins axi_dma_4/axi_resetn] [get_bd_pins ps7_0_axi_periph/M04_ARESETN] \
  [get_bd_pins axi_dma_5/axi_resetn] [get_bd_pins ps7_0_axi_periph/M05_ARESETN] [get_bd_pins axi_dma_6/axi_resetn] \
  [get_bd_pins ps7_0_axi_periph/M06_ARESETN] [get_bd_pins axi_dma_7/axi_resetn] [get_bd_pins ps7_0_axi_periph/M07_ARESETN] \
  [get_bd_pins axi_mem_intercon/S00_ARESETN] [get_bd_pins axi_mem_intercon/M00_ARESETN] \
  [get_bd_pins axi_mem_intercon/ARESETN] [get_bd_pins axi_mem_intercon/S01_ARESETN] \
  [get_bd_pins axi_mem_intercon/S02_ARESETN] [get_bd_pins axi_mem_intercon/S03_ARESETN] \
  [get_bd_pins axi_mem_intercon/S04_ARESETN] [get_bd_pins axi_mem_intercon/S05_ARESETN] \
  [get_bd_pins axi_mem_intercon/S06_ARESETN] [get_bd_pins axi_mem_intercon/S07_ARESETN] \
  [get_bd_pins axi_gpio_0/s_axi_aresetn] [get_bd_pins ps7_0_axi_periph/M08_ARESETN] [get_bd_pins util_vector_logic_1/Op1] \
  [get_bd_pins util_vector_logic_3/Op1] [get_bd_pins util_vector_logic_5/Op1] [get_bd_pins util_vector_logic_6/Op1] \
  [get_bd_pins util_vector_logic_4/Op1] [get_bd_pins util_vector_logic_8/Op1] [get_bd_pins util_vector_logic_7/Op1] \
  [get_bd_pins util_vector_logic_2/Op1] [get_bd_pins ps7_0_axi_periph/M09_ARESETN] [get_bd_pins axi_gpio_1/s_axi_aresetn] \
  [get_bd_pins axi_gpio_2/s_axi_aresetn] [get_bd_pins ps7_0_axi_periph/M10_ARESETN] [get_bd_pins axi_gpio_3/s_axi_aresetn] \
  [get_bd_pins ps7_0_axi_periph/M11_ARESETN] [get_bd_pins axi_gpio_4/s_axi_aresetn] \
  [get_bd_pins ps7_0_axi_periph/M12_ARESETN] [get_bd_pins signal_detector_0/m00_axis_aresetn] \
  [get_bd_pins signal_detector_1/m00_axis_aresetn] [get_bd_pins signal_detector_2/m00_axis_aresetn] \
  [get_bd_pins signal_detector_3/m00_axis_aresetn] [get_bd_pins signal_detector_4/m00_axis_aresetn] \
  [get_bd_pins signal_detector_5/m00_axis_aresetn] [get_bd_pins signal_detector_7/m00_axis_aresetn] \
  [get_bd_pins signal_detector_6/m00_axis_aresetn] [get_bd_pins signal_generator_0/m00_axis_aresetn]
connect_bd_net [get_bd_pins axi_dma_7/s2mm_introut] [get_bd_pins xlconcat_0/In7]
connect_bd_net [get_bd_pins axi_dma_6/s2mm_introut] [get_bd_pins xlconcat_0/In6]
connect_bd_net [get_bd_pins axi_dma_5/s2mm_introut] [get_bd_pins xlconcat_0/In5]
connect_bd_net [get_bd_pins axi_dma_0/s2mm_introut] [get_bd_pins xlconcat_0/In0]
connect_bd_net [get_bd_pins axi_dma_4/s2mm_introut] [get_bd_pins xlconcat_0/In4]
connect_bd_net [get_bd_pins axi_dma_3/s2mm_introut] [get_bd_pins xlconcat_0/In3]
connect_bd_net [get_bd_pins axi_dma_2/s2mm_introut] [get_bd_pins xlconcat_0/In2]
connect_bd_net [get_bd_pins axi_dma_1/s2mm_introut] [get_bd_pins xlconcat_0/In1]
connect_bd_net [get_bd_pins xlconcat_0/dout] [get_bd_pins processing_system7_0/IRQ_F2P]
connect_bd_net [get_bd_pins signal_detector_5/signal_state] [get_bd_pins xlconcat_1/In5] [get_bd_pins or_0/in5]
connect_bd_net [get_bd_pins signal_detector_0/signal_state] [get_bd_pins xlconcat_1/In0] [get_bd_pins or_0/in0]
connect_bd_net [get_bd_pins signal_detector_4/signal_state] [get_bd_pins xlconcat_1/In4] [get_bd_pins or_0/in4]
connect_bd_net [get_bd_pins signal_detector_3/signal_state] [get_bd_pins xlconcat_1/In3] [get_bd_pins or_0/in3]
connect_bd_net [get_bd_pins signal_detector_2/signal_state] [get_bd_pins xlconcat_1/In2] [get_bd_pins or_0/in2]
connect_bd_net [get_bd_pins signal_detector_1/signal_state] [get_bd_pins xlconcat_1/In1] [get_bd_pins or_0/in1]
connect_bd_net [get_bd_pins xlconcat_1/dout] [get_bd_ports leds_8bits1]
connect_bd_net [get_bd_pins enable_splitter_0/out7] [get_bd_pins util_vector_logic_9/Op2] [get_bd_pins signal_detector_7/enabled]
connect_bd_net [get_bd_pins enable_splitter_0/out5] [get_bd_pins signal_detector_5/enabled]
connect_bd_net [get_bd_pins enable_splitter_0/out4] [get_bd_pins signal_detector_4/enabled]
connect_bd_net [get_bd_pins enable_splitter_0/out3] [get_bd_pins signal_detector_3/enabled]
connect_bd_net [get_bd_pins enable_splitter_0/out2] [get_bd_pins signal_detector_2/enabled]
connect_bd_net [get_bd_pins enable_splitter_0/out1] [get_bd_pins signal_detector_1/enabled]
connect_bd_net [get_bd_ports sws_8bits] [get_bd_pins enable_splitter_0/switch_input] [get_bd_pins axi_gpio_2/gpio_io_i]
connect_bd_net [get_bd_pins axi_gpio_0/gpio_io_o] [get_bd_pins enable_splitter_0/gpio_input]
connect_bd_net [get_bd_pins signal_input_0/out1] [get_bd_pins signal_detector_1/signal_input]
connect_bd_net [get_bd_pins signal_input_0/out2] [get_bd_pins signal_detector_2/signal_input]
connect_bd_net [get_bd_pins signal_input_0/out3] [get_bd_pins signal_detector_3/signal_input]
connect_bd_net [get_bd_pins signal_input_0/out4] [get_bd_pins signal_detector_4/signal_input]
connect_bd_net [get_bd_pins signal_input_0/out5] [get_bd_pins signal_detector_5/signal_input]
connect_bd_net [get_bd_pins signal_input_0/out7] [get_bd_pins util_vector_logic_10/Op1] [get_bd_pins signal_detector_7/signal_input]
connect_bd_net [get_bd_ports pmod_input] [get_bd_pins signal_input_0/signal_input]
connect_bd_net [get_bd_pins enable_splitter_0/out0] [get_bd_pins signal_detector_0/enabled]
connect_bd_net [get_bd_pins signal_input_0/out0] [get_bd_pins util_vector_logic_0/Op1]
connect_bd_net [get_bd_pins util_vector_logic_0/Res] [get_bd_pins signal_detector_0/signal_input]
connect_bd_net [get_bd_pins signal_detector_0/fifo_reset] [get_bd_pins util_vector_logic_1/Op2]
connect_bd_net [get_bd_pins signal_detector_2/fifo_reset] [get_bd_pins util_vector_logic_3/Op2]
connect_bd_net [get_bd_pins signal_detector_3/fifo_reset] [get_bd_pins util_vector_logic_4/Op2]
connect_bd_net [get_bd_pins signal_detector_4/fifo_reset] [get_bd_pins util_vector_logic_5/Op2]
connect_bd_net [get_bd_pins signal_detector_5/fifo_reset] [get_bd_pins util_vector_logic_6/Op2]
connect_bd_net [get_bd_pins signal_detector_1/fifo_reset] [get_bd_pins util_vector_logic_2/Op2]
connect_bd_net [get_bd_pins axi_gpio_1/gpio_io_o] \
  [get_bd_pins signal_detector_0/number_words] [get_bd_pins signal_detector_1/number_words] \
  [get_bd_pins signal_detector_2/number_words] [get_bd_pins signal_detector_3/number_words] \
  [get_bd_pins signal_detector_4/number_words] [get_bd_pins signal_detector_5/number_words] \
  [get_bd_pins signal_detector_7/number_words] [get_bd_pins signal_detector_6/number_words] \
  [get_bd_pins signal_generator_0/number_words]
connect_bd_net [get_bd_pins signal_detector_6/signal_state] [get_bd_pins xlconcat_1/In6] [get_bd_pins or_0/in6]
connect_bd_net [get_bd_pins signal_detector_6/fifo_reset] [get_bd_pins util_vector_logic_7/Op2]
connect_bd_net [get_bd_pins enable_splitter_0/out6] [get_bd_pins signal_detector_6/enabled]
connect_bd_net [get_bd_pins signal_input_0/out6] [get_bd_pins signal_detector_6/signal_input]
connect_bd_net [get_bd_pins util_vector_logic_9/Res] [get_bd_pins signal_generator_0/enabled]
connect_bd_net [get_bd_pins signal_detector_7/m00_axis_tdata] [get_bd_pins input_selector_0/s01_axis_tdata]
connect_bd_net [get_bd_pins signal_detector_7/m00_axis_tkeep] [get_bd_pins input_selector_0/s01_axis_tkeep]
connect_bd_net [get_bd_pins signal_detector_7/m00_axis_tlast] [get_bd_pins input_selector_0/s01_axis_tlast]
connect_bd_net [get_bd_pins signal_detector_7/m00_axis_tvalid] [get_bd_pins input_selector_0/s01_axis_tvalid]
connect_bd_net [get_bd_pins input_selector_0/s01_axis_tready] [get_bd_pins signal_detector_7/m00_axis_tready]
connect_bd_net [get_bd_pins input_selector_0/s00_axis_tready] [get_bd_pins signal_generator_0/m00_axis_tready]
connect_bd_net [get_bd_pins signal_generator_0/m00_axis_tdata] [get_bd_pins input_selector_0/s00_axis_tdata]
connect_bd_net [get_bd_pins signal_generator_0/m00_axis_tlast] [get_bd_pins input_selector_0/s00_axis_tlast]
connect_bd_net [get_bd_pins signal_generator_0/m00_axis_tvalid] [get_bd_pins input_selector_0/s00_axis_tvalid]
connect_bd_net [get_bd_pins signal_generator_0/m00_axis_tkeep] [get_bd_pins input_selector_0/s00_axis_tkeep]
connect_bd_net [get_bd_pins input_selector_0/fifo_reset] [get_bd_pins util_vector_logic_8/Op2]
connect_bd_net [get_bd_pins signal_generator_0/fifo_reset] [get_bd_pins input_selector_0/fifo_reset_0]
connect_bd_net [get_bd_pins signal_detector_7/fifo_reset] [get_bd_pins input_selector_0/fifo_reset_1]
connect_bd_net [get_bd_pins signal_generator_0/signal_state] [get_bd_pins input_selector_0/signal_state_0]
connect_bd_net [get_bd_pins input_selector_0/signal_state] [get_bd_pins xlconcat_1/In7] [get_bd_pins or_0/in7]
connect_bd_net [get_bd_pins signal_detector_7/signal_state] [get_bd_pins input_selector_0/signal_state_1]
connect_bd_net [get_bd_pins input_trigger_0/trigger_out2] [get_bd_pins signal_detector_2/trigger_input]
connect_bd_net [get_bd_pins input_trigger_0/trigger_out3] [get_bd_pins signal_detector_3/trigger_input]
connect_bd_net [get_bd_pins input_trigger_0/trigger_out7] [get_bd_pins signal_detector_7/trigger_input]
connect_bd_net [get_bd_pins input_trigger_0/trigger_out4] [get_bd_pins signal_detector_4/trigger_input]
connect_bd_net [get_bd_pins input_trigger_0/trigger_out1] [get_bd_pins signal_detector_1/trigger_input]
connect_bd_net [get_bd_pins input_trigger_0/trigger_out5] [get_bd_pins signal_detector_5/trigger_input]
connect_bd_net [get_bd_pins input_trigger_0/trigger_out0] [get_bd_pins signal_detector_0/trigger_input]
connect_bd_net [get_bd_pins input_trigger_0/trigger_out6] [get_bd_pins signal_detector_6/trigger_input]
connect_bd_net [get_bd_pins axi_gpio_4/gpio_io_o] [get_bd_pins input_trigger_0/enabled]
connect_bd_net [get_bd_ports trigger_input] [get_bd_pins input_trigger_0/trigger_input]
connect_bd_net [get_bd_pins or_0/out0] [get_bd_ports trigger_out]
connect_bd_net [get_bd_ports btnc] [get_bd_pins util_vector_logic_0/Op2] [get_bd_pins util_vector_logic_10/Op2]
connect_bd_net [get_bd_pins ip_8_to_1_and_7_0/out0] [get_bd_pins input_selector_0/selector] [get_bd_pins util_vector_logic_9/Op1]
connect_bd_net [get_bd_pins util_vector_logic_10/Res] [get_bd_pins signal_generator_0/signal_input]
connect_bd_net [get_bd_pins fifo_generator_7/s_axis_tready] [get_bd_pins input_selector_0/m00_axis_tready]
connect_bd_net [get_bd_pins input_selector_0/m00_axis_tvalid] [get_bd_pins fifo_generator_7/s_axis_tvalid]
connect_bd_net [get_bd_pins input_selector_0/m00_axis_tdata] [get_bd_pins fifo_generator_7/s_axis_tdata]
connect_bd_net [get_bd_pins input_selector_0/m00_axis_tkeep] [get_bd_pins fifo_generator_7/s_axis_tkeep]
connect_bd_net [get_bd_pins input_selector_0/m00_axis_tlast] [get_bd_pins fifo_generator_7/s_axis_tlast]
connect_bd_net [get_bd_pins util_vector_logic_8/Res] [get_bd_pins fifo_generator_7/s_aresetn] [get_bd_pins hold_signal_7/m00_axis_aresetn]
connect_bd_net [get_bd_pins util_vector_logic_7/Res] [get_bd_pins fifo_generator_6/s_aresetn] [get_bd_pins hold_signal_6/m00_axis_aresetn]
connect_bd_net [get_bd_pins util_vector_logic_6/Res] [get_bd_pins fifo_generator_5/s_aresetn] [get_bd_pins hold_signal_5/m00_axis_aresetn]
connect_bd_net [get_bd_pins util_vector_logic_5/Res] [get_bd_pins fifo_generator_4/s_aresetn] [get_bd_pins hold_signal_4/m00_axis_aresetn]
connect_bd_net [get_bd_pins util_vector_logic_4/Res] [get_bd_pins fifo_generator_3/s_aresetn] [get_bd_pins hold_signal_3/m00_axis_aresetn]
connect_bd_net [get_bd_pins util_vector_logic_1/Res] [get_bd_pins fifo_generator_0/s_aresetn] [get_bd_pins hold_signal_0/m00_axis_aresetn]
connect_bd_net [get_bd_pins util_vector_logic_3/Res] [get_bd_pins fifo_generator_2/s_aresetn] [get_bd_pins hold_signal_2/m00_axis_aresetn]
connect_bd_net [get_bd_pins util_vector_logic_2/Res] [get_bd_pins fifo_generator_1/s_aresetn] [get_bd_pins hold_signal_1/m00_axis_aresetn]
connect_bd_net [get_bd_pins ip_8_to_1_and_7_0/out1] [get_bd_pins signal_generator_0/signal_frequency]
connect_bd_net [get_bd_pins axi_gpio_3/gpio_io_o] [get_bd_pins ip_8_to_1_and_7_0/in0]
connect_bd_net [get_bd_pins axi_gpio_3/gpio2_io_o] [get_bd_pins signal_generator_0/signal_count]
connect_bd_net [get_bd_pins fifo_generator_0/axis_overflow] [get_bd_pins hold_signal_0/signal_in]
connect_bd_net [get_bd_pins fifo_generator_1/axis_overflow] [get_bd_pins hold_signal_1/signal_in]
connect_bd_net [get_bd_pins fifo_generator_3/axis_overflow] [get_bd_pins hold_signal_3/signal_in]
connect_bd_net [get_bd_pins fifo_generator_5/axis_overflow] [get_bd_pins hold_signal_5/signal_in]
connect_bd_net [get_bd_pins fifo_generator_6/axis_overflow] [get_bd_pins hold_signal_6/signal_in]
connect_bd_net [get_bd_pins fifo_generator_4/axis_overflow] [get_bd_pins hold_signal_4/signal_in]
connect_bd_net [get_bd_pins fifo_generator_2/axis_overflow] [get_bd_pins hold_signal_2/signal_in]
connect_bd_net [get_bd_pins fifo_generator_7/axis_overflow] [get_bd_pins hold_signal_7/signal_in]
connect_bd_net [get_bd_pins hold_signal_0/signal_out] [get_bd_pins xlconcat_0/In8]
connect_bd_net [get_bd_pins hold_signal_1/signal_out] [get_bd_pins xlconcat_0/In9]
connect_bd_net [get_bd_pins hold_signal_2/signal_out] [get_bd_pins xlconcat_0/In10]
connect_bd_net [get_bd_pins hold_signal_3/signal_out] [get_bd_pins xlconcat_0/In11]
connect_bd_net [get_bd_pins hold_signal_4/signal_out] [get_bd_pins xlconcat_0/In12]
connect_bd_net [get_bd_pins hold_signal_5/signal_out] [get_bd_pins xlconcat_0/In13]
connect_bd_net [get_bd_pins hold_signal_6/signal_out] [get_bd_pins xlconcat_0/In14]
connect_bd_net [get_bd_pins hold_signal_7/signal_out] [get_bd_pins xlconcat_0/In15]

# ---- address map ----
assign_bd_address -offset 0x10000000 -range 256M -target_address_space [get_bd_addr_spaces axi_dma_0/Data_S2MM] [get_bd_addr_segs processing_system7_0/S_AXI_HP0/HP0_DDR_LOWOCM]
assign_bd_address -offset 0x10000000 -range 256M -target_address_space [get_bd_addr_spaces axi_dma_1/Data_S2MM] [get_bd_addr_segs processing_system7_0/S_AXI_HP0/HP0_DDR_LOWOCM]
assign_bd_address -offset 0x10000000 -range 256M -target_address_space [get_bd_addr_spaces axi_dma_2/Data_S2MM] [get_bd_addr_segs processing_system7_0/S_AXI_HP0/HP0_DDR_LOWOCM]
assign_bd_address -offset 0x10000000 -range 256M -target_address_space [get_bd_addr_spaces axi_dma_3/Data_S2MM] [get_bd_addr_segs processing_system7_0/S_AXI_HP0/HP0_DDR_LOWOCM]
assign_bd_address -offset 0x10000000 -range 256M -target_address_space [get_bd_addr_spaces axi_dma_4/Data_S2MM] [get_bd_addr_segs processing_system7_0/S_AXI_HP0/HP0_DDR_LOWOCM]
assign_bd_address -offset 0x10000000 -range 256M -target_address_space [get_bd_addr_spaces axi_dma_5/Data_S2MM] [get_bd_addr_segs processing_system7_0/S_AXI_HP0/HP0_DDR_LOWOCM]
assign_bd_address -offset 0x10000000 -range 256M -target_address_space [get_bd_addr_spaces axi_dma_6/Data_S2MM] [get_bd_addr_segs processing_system7_0/S_AXI_HP0/HP0_DDR_LOWOCM]
assign_bd_address -offset 0x10000000 -range 256M -target_address_space [get_bd_addr_spaces axi_dma_7/Data_S2MM] [get_bd_addr_segs processing_system7_0/S_AXI_HP0/HP0_DDR_LOWOCM]
assign_bd_address -offset 0x40400000 -range 64K -target_address_space [get_bd_addr_spaces processing_system7_0/Data] [get_bd_addr_segs axi_dma_0/S_AXI_LITE/Reg]
assign_bd_address -offset 0x40410000 -range 64K -target_address_space [get_bd_addr_spaces processing_system7_0/Data] [get_bd_addr_segs axi_dma_1/S_AXI_LITE/Reg]
assign_bd_address -offset 0x40420000 -range 64K -target_address_space [get_bd_addr_spaces processing_system7_0/Data] [get_bd_addr_segs axi_dma_2/S_AXI_LITE/Reg]
assign_bd_address -offset 0x40430000 -range 64K -target_address_space [get_bd_addr_spaces processing_system7_0/Data] [get_bd_addr_segs axi_dma_3/S_AXI_LITE/Reg]
assign_bd_address -offset 0x40440000 -range 64K -target_address_space [get_bd_addr_spaces processing_system7_0/Data] [get_bd_addr_segs axi_dma_4/S_AXI_LITE/Reg]
assign_bd_address -offset 0x40450000 -range 64K -target_address_space [get_bd_addr_spaces processing_system7_0/Data] [get_bd_addr_segs axi_dma_5/S_AXI_LITE/Reg]
assign_bd_address -offset 0x40460000 -range 64K -target_address_space [get_bd_addr_spaces processing_system7_0/Data] [get_bd_addr_segs axi_dma_6/S_AXI_LITE/Reg]
assign_bd_address -offset 0x40470000 -range 64K -target_address_space [get_bd_addr_spaces processing_system7_0/Data] [get_bd_addr_segs axi_dma_7/S_AXI_LITE/Reg]
assign_bd_address -offset 0x41200000 -range 64K -target_address_space [get_bd_addr_spaces processing_system7_0/Data] [get_bd_addr_segs axi_gpio_0/S_AXI/Reg]
assign_bd_address -offset 0x41210000 -range 64K -target_address_space [get_bd_addr_spaces processing_system7_0/Data] [get_bd_addr_segs axi_gpio_1/S_AXI/Reg]
assign_bd_address -offset 0x41220000 -range 64K -target_address_space [get_bd_addr_spaces processing_system7_0/Data] [get_bd_addr_segs axi_gpio_2/S_AXI/Reg]
assign_bd_address -offset 0x41230000 -range 64K -target_address_space [get_bd_addr_spaces processing_system7_0/Data] [get_bd_addr_segs axi_gpio_3/S_AXI/Reg]
assign_bd_address -offset 0x41240000 -range 64K -target_address_space [get_bd_addr_spaces processing_system7_0/Data] [get_bd_addr_segs axi_gpio_4/S_AXI/Reg]

validate_bd_design
save_bd_design
